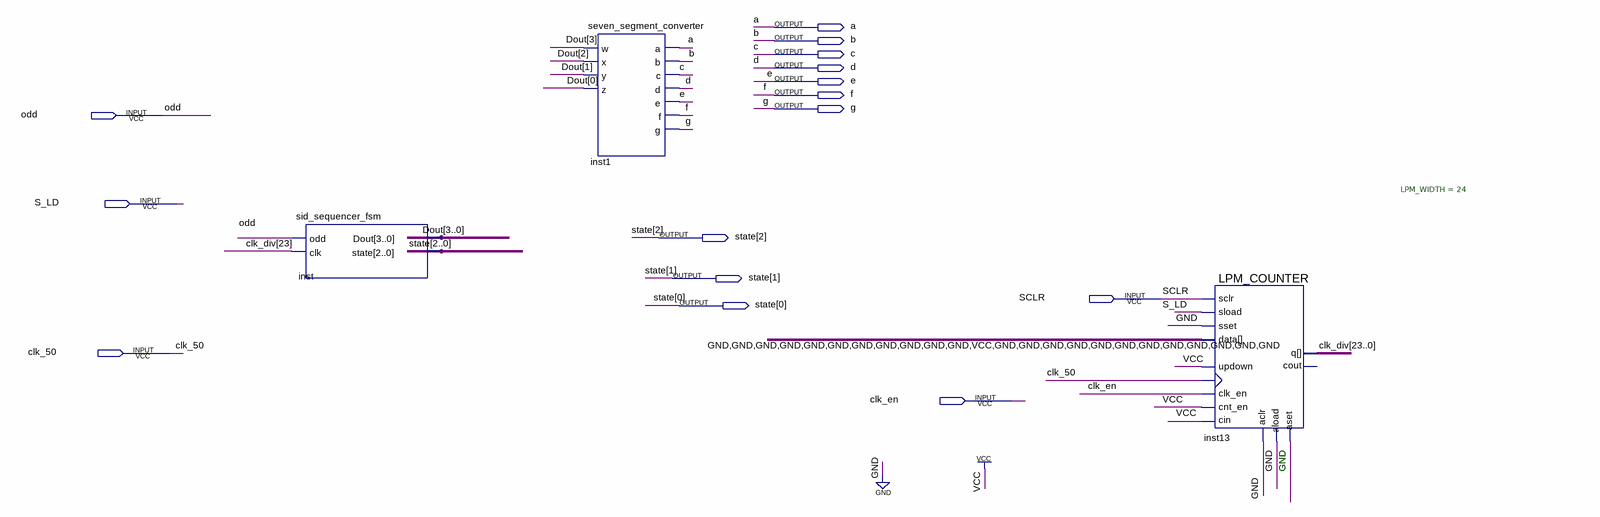
[diagram p0: schematic sheet]
// Quartus schematic sid_sequencer.bdf as structural Verilog: 3 symbols, 15 pins
module sid_sequencer (
  input  odd,
  input  S_LD,
  input  SCLR,
  input  clk_50,
  input  clk_en,
  output a,
  output b,
  output c,
  output d,
  output e,
  output f,
  output g,
  output [2:0] state
);

  wire [3:0] Dout;
  wire [23:0] clk_div;

  sid_sequencer_fsm inst (.odd(odd), .clk(clk_div[23]), .Dout(Dout), .state(state));
  seven_segment_converter inst1 (
    .w(Dout[3]), .x(Dout[2]), .y(Dout[1]), .z(Dout[0]), .a(a), .b(b), .c(c), .d(d), .e(e), .f(f), .g(g));
  LPM_COUNTER #(.LPM_WIDTH(24)) inst13 (
    .sload(S_LD), .data(24'b000000000001000000000000), .clock(clk_50), .clk_en(clk_en), .aload(1'b0),
    .aclr(1'b0), .aset(1'b0), .cin(1'b1), .sset(1'b0), .updown(1'b1), .cnt_en(1'b1), .sclr(SCLR), .q(clk_div));  // open: cout

  // Notes on the sheet:
  //   GND
endmodule
